# EAGLE design mfos_vco (EAGLE 7.2.0)
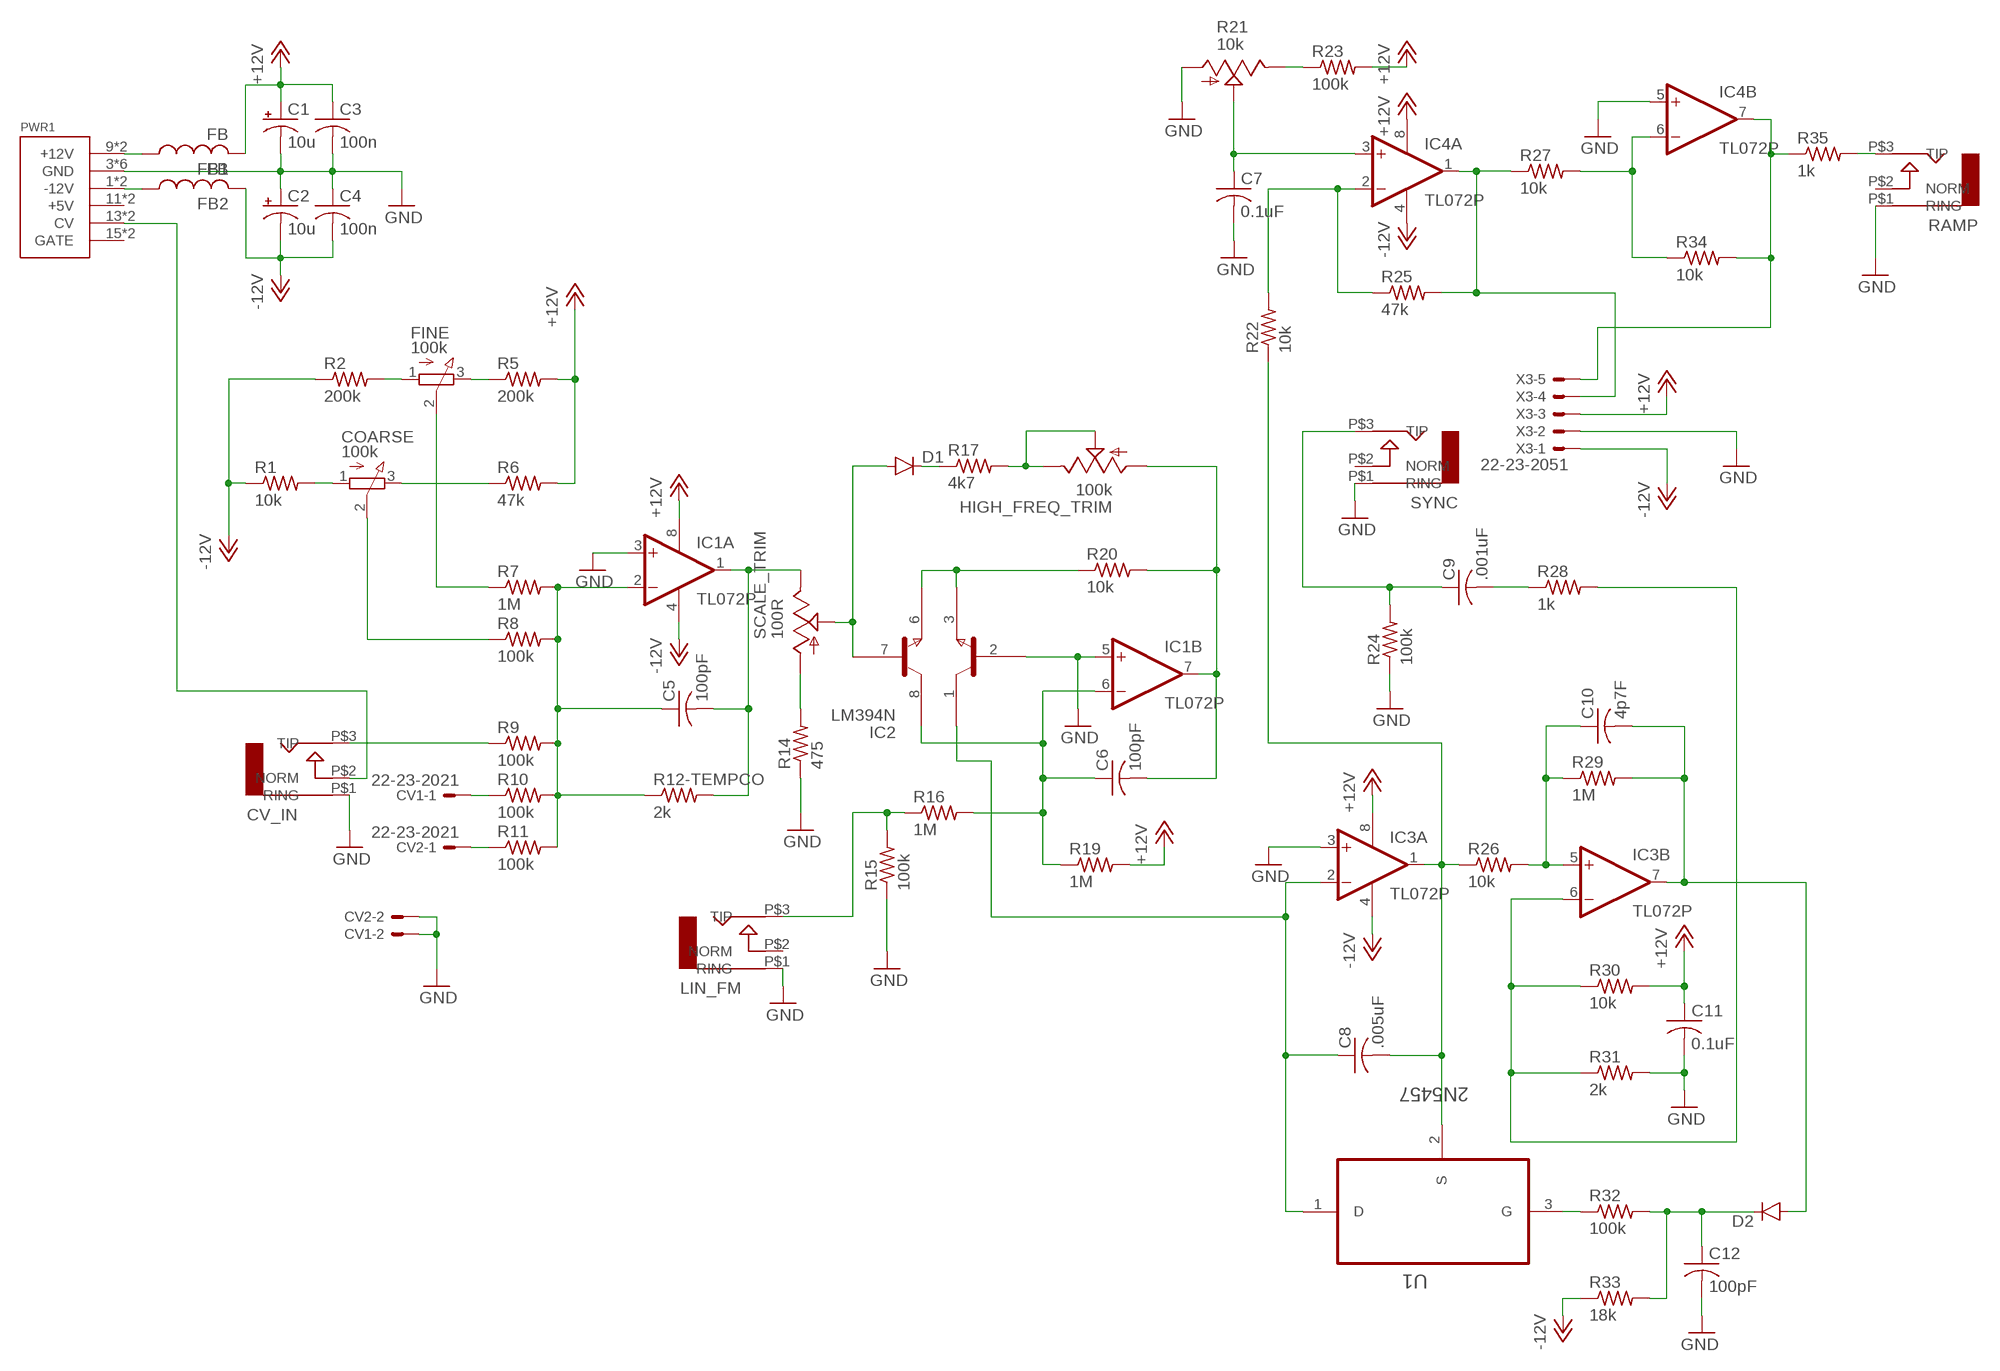
[diagram p0: schematic, sheet 1]

## Parts
C1  10u  CPOL-USB45181A  [B45181A]
C2  10u  CPOL-USB45181A  [B45181A]
C3  100n  C-US050-024X044  [C050-024X044]
C4  100n  C-US050-024X044  [C050-024X044]
C5  100pF  C-US050-024X044  [C050-024X044]
C6  100pF  C-US050-024X044  [C050-024X044]
C7  0.1uF  C-US050-024X044  [C050-024X044]
C8  .005uF  C-US050-024X044  [C050-024X044]
C9  .001uF  C-US050-024X044  [C050-024X044]
C10  4p7F  C-US050-024X044  [C050-024X044]
C11  0.1uF  C-US050-024X044  [C050-024X044]
C12  100pF  C-US050-024X044  [C050-024X044]
COARSE  100k  3RP/1610N  [3RP/1610N]
CV1  22-23-2021  [22-23-2021]
CV2  22-23-2021  [22-23-2021]
CV_IN  AUDIO-JACK  [ERTHENVAR-JACK-90DEG]
D1  DIODE1N4148  [DIODE-1N4148]
D2  DIODE1N4148  [DIODE-1N4148]
FB1  FB  [FB]
FB2  FB  [FB]
FINE  100k  3RP/1610N  [3RP/1610N]
HIGH_FREQ_TRIM  100k  TRIM_US-B64Y  [B64Y]
IC1  TL072P  [DIL08]
IC2  LM394N  [DIL08]
IC3  TL072P  [DIL08]
IC4  TL072P  [DIL08]
LIN_FM  AUDIO-JACK  [ERTHENVAR-JACK-90DEG]
PWR1  POWER  [POWER_16]
R1  10k  R-US_0207/7  [0207/7]
R2  200k  R-US_0207/7  [0207/7]
R5  200k  R-US_0207/7  [0207/7]
R6  47k  R-US_0207/7  [0207/7]
R7  1M  R-US_0207/7  [0207/7]
R8  100k  R-US_0207/7  [0207/7]
R9  100k  R-US_0207/7  [0207/7]
R10  100k  R-US_0207/7  [0207/7]
R11  100k  R-US_0207/7  [0207/7]
R12-TEMPCO  2k  R-US_0207/2V  [0207/2V]
R14  475  R-US_0207/7  [0207/7]
R15  100k  R-US_0207/7  [0207/7]
R16  1M  R-US_0207/7  [0207/7]
R17  4k7  R-US_0207/7  [0207/7]
R19  1M  R-US_0207/7  [0207/7]
R20  10k  R-US_0207/7  [0207/7]
R21  10k  TRIM_US-B64Y  [B64Y]
R22  10k  R-US_0207/7  [0207/7]
R23  100k  R-US_0207/10  [0207/10]
R24  100k  R-US_0207/7  [0207/7]
R25  47k  R-US_0207/7  [0207/7]
R26  10k  R-US_0207/7  [0207/7]
R27  10k  R-US_0207/7  [0207/7]
R28  1k  R-US_0207/7  [0207/7]
R29  1M  R-US_0207/7  [0207/7]
R30  10k  R-US_0207/7  [0207/7]
R31  2k  R-US_0207/7  [0207/7]
R32  100k  R-US_0207/7  [0207/7]
R33  18k  R-US_0207/7  [0207/7]
R34  10k  R-US_0207/7  [0207/7]
R35  1k  R-US_0207/7  [0207/7]
RAMP  AUDIO-JACK  [ERTHENVAR-JACK-90DEG]
SCALE_TRIM  100R  TRIM_US-B64Y  [B64Y]
SYNC  AUDIO-JACK  [ERTHENVAR-JACK-90DEG]
U1  2N5457  [TO127P254X732-3]
X3  22-23-2051  [22-23-2051]

## Nets
+12V: C1.+ C3.1 C11.1 FB1.P$2 IC1.8(P:V+) IC3.8(P:V+) IC4.8(P:V+) R5.2 R6.2 R19.2 R23.2 R30.2 X3.3
-12V: C2.- C4.2 FB2.P$2 IC1.4(P:V-) IC3.4(P:V-) IC4.4(P:V-) R1.1 R2.1 R33.1 X3.1
GND: C1.- C2.+ C3.2 C4.1 C7.2 C11.2 C12.2 CV1.2 CV2.2 CV_IN.P$1(RING) IC1.3(A:+IN) IC1.5(B:+IN) IC2.2(B1) IC3.3(A:+IN) IC4.5(B:+IN) LIN_FM.P$1(RING) PWR1.3(GND) PWR1.4(GND) PWR1.5(GND) PWR1.6(GND) PWR1.7(GND) PWR1.8(GND) R14.1 R15.1 R21.A R24.1 R31.2 RAMP.P$1(RING) SYNC.P$1(RING) X3.2
N$1: COARSE.1(A) R1.2
N$2: FINE.1(A) R2.2
N$3: FINE.3(E) R5.1
N$4: COARSE.3(E) R6.1
N$5: FINE.2(S) R7.1
N$6: COARSE.2(S) R8.1
N$7: R14.2 SCALE_TRIM.A
N$8: D1.A IC2.7(B2) SCALE_TRIM.S
N$9: C5.2 IC1.1(A:OUT) R12-TEMPCO.2 SCALE_TRIM.E
N$10: C5.1 IC1.2(A:-IN) R7.2 R8.2 R9.2 R10.2 R11.2 R12-TEMPCO.1
N$11: CV_IN.P$2(NORM) PWR1.13(CV) PWR1.14(CV)
N$12: IC2.3(E1) IC2.6(E2) R20.1
N$14: HIGH_FREQ_TRIM.E HIGH_FREQ_TRIM.S R17.2
N$15: D1.C R17.1
N$16: C6.2 HIGH_FREQ_TRIM.A IC1.7(B:OUT) R20.2
N$17: CV_IN.P$3(TIP) R9.1
N$18: CV1.1 R10.1
N$19: CV2.1 R11.1
N$20: LIN_FM.P$3(TIP) R15.2 R16.1
N$21: C8.2 IC3.1(A:OUT) R22.1 R26.1 U1.2(S)
N$22: C10.1 IC3.5(B:+IN) R26.2 R29.1
N$23: C8.1 IC2.1(C1) IC3.2(A:-IN) U1.1(D)
N$24: C9.2 R28.1
N$25: C9.1 R24.2 SYNC.P$3(TIP)
N$26: IC3.6(B:-IN) R28.2 R30.1 R31.1
N$27: R21.E R23.1
N$28: C7.1 IC4.3(A:+IN) R21.S
N$29: R32.1 U1.3(G)
N$30: C10.2 D2.A IC3.7(B:OUT) R29.2
N$31: IC4.2(A:-IN) R22.2 R25.1
N$32: C12.1 D2.C R32.2 R33.2
N$33: IC4.1(A:OUT) R25.2 R27.1 X3.4
N$34: IC4.6(B:-IN) R27.2 R34.1
N$35: IC4.7(B:OUT) R34.2 R35.1 X3.5
N$36: R35.2 RAMP.P$3(TIP)
N$38: FB1.P$1 PWR1.9(+12V) PWR1.10(+12V)
N$39: FB2.P$1 PWR1.1(-12V) PWR1.2(-12V)
N$40: C6.1 IC1.6(B:-IN) IC2.8(C2) R16.2 R19.1
Unconnected: LIN_FM.P$2(NORM) PWR1.11(+5V) PWR1.12(+5V) PWR1.15(GATE) PWR1.16(GATE) RAMP.P$2(NORM) SYNC.P$2(NORM)

## Library data of the parts
C1 C2 = rcl:CPOL-US: POLARIZED CAPACITOR, American symbol
C3-C12 = rcl:C-US: CAPACITOR, American symbol
COARSE FINE = pot:3RP/1610N: 16mm Potentiometer one level Source: http://www.alphapotentiometers.net/html/16mm_pot_2.html
CV1 CV2 = con-molex:22-23-2021: .100" (2.54mm) Center Header - 2 Pin; MF: MOLEX; MPN: 22-23-2021; OC_FARNELL: 1462926; OC_NEWARK: 25C3832
CV_IN LIN_FM RAMP SYNC = erthenvar:AUDIO-JACK: Switching Mono 3.5mm Audio Jack from Erthenvar.
D1 D2 = SparkFun-DiscreteSemi:DIODE: Diode These are standard reverse protection diodes and small signal diodes. SMA package can handle up to about 1A. SOD-323 can handle about 200mA. What the SOD-323 package when ordering, there are some mfgs out there that are 5-pin packages.
FB1 FB2 = adafruit:FB: Ferrite bead Digikey #P9821BK-ND
HIGH_FREQ_TRIM R21 SCALE_TRIM = pot:TRIM_US-: POTENTIOMETER
IC1 IC3 IC4 = linear:TL072: OP AMP
IC2 = synthdiy:LM394: National Dual TRANSISTOR
PWR1 = eurorack:POWER
R1 R2 R5-R11 R12-TEMPCO R14-R17 R19 R20 R22-R35 = rcl:R-US_: RESISTOR, American symbol
U1 = Fairchild_By_element14_Batch_1:2N5457: Transistor; MPN: 2N5457; OC_FARNELL: 1653694; OC_NEWARK: 58K2809; PACKAGE: TO-92; SUPPLIER: Fairchild
X3 = con-molex:22-23-2051: .100" (2.54mm) Center Header - 5 Pin; MF: MOLEX; MPN: 22-23-2051; OC_FARNELL: 1462952; OC_NEWARK: 38C9178

## Board
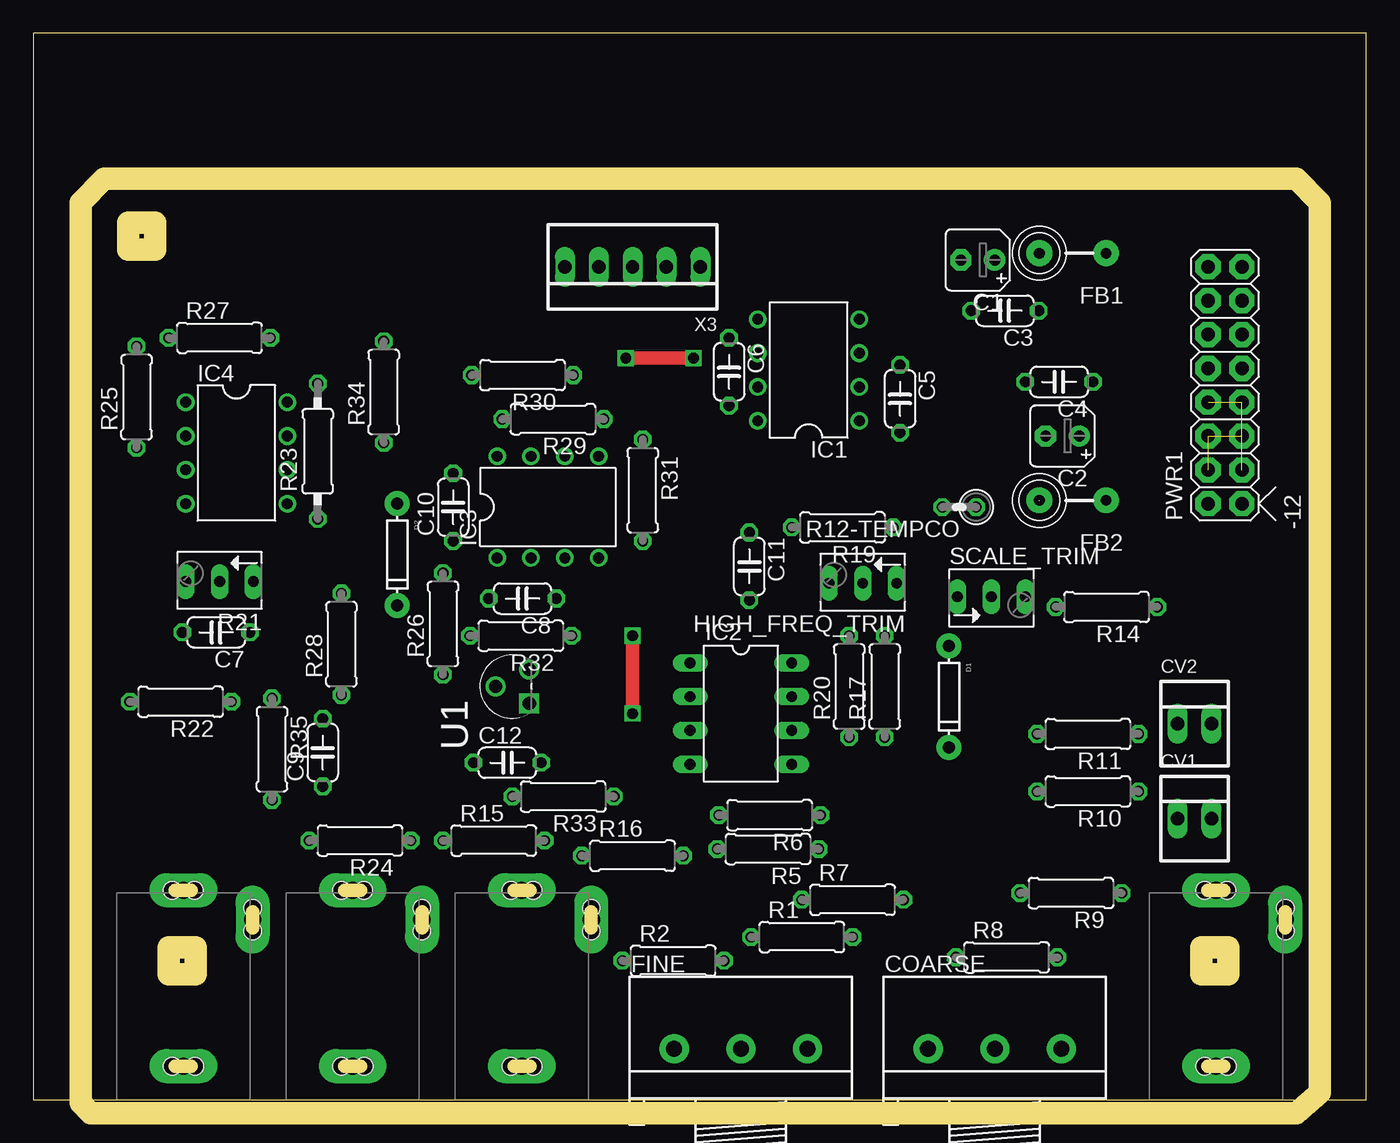
[diagram p1: board, top side]
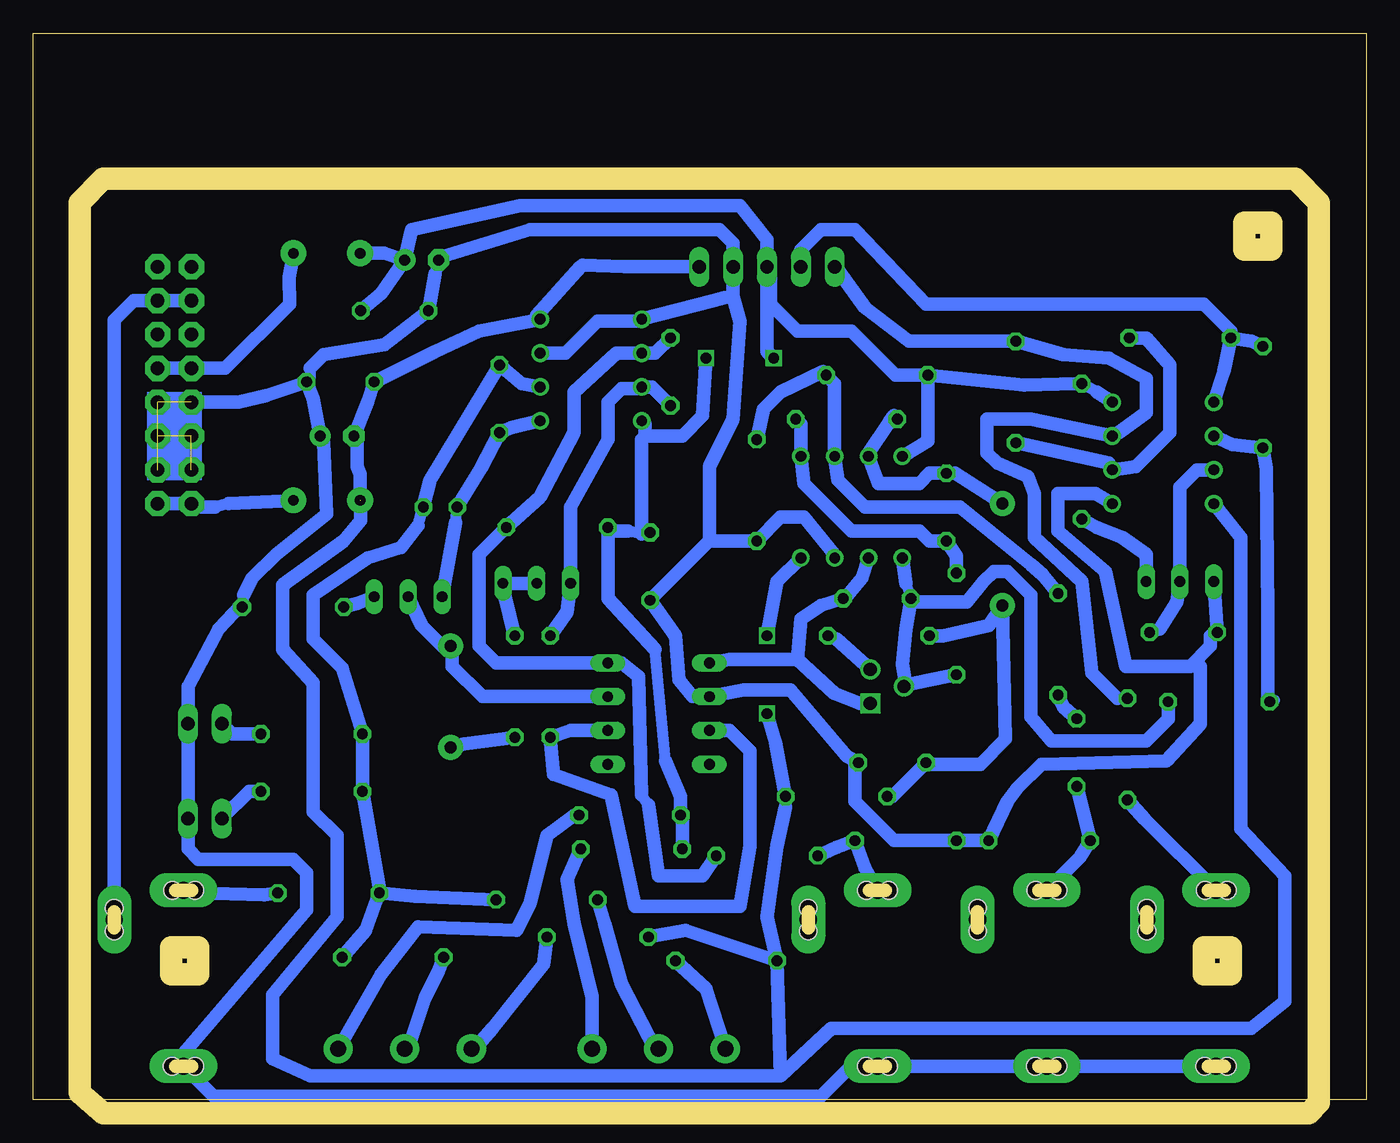
[diagram p2: board, bottom side, seen from below]

Size 100 x 80 mm. Coordinates in mm from the lower left corner, seen from the top.
Outline: 0,0 100,0 100,80 0,80 0,0
Copper layers (1*16): Top 0.035mm / dielectric 1.5mm / Bottom 0.035mm
Design rules "default *": minimum track width 26mil, minimum drill 31mil, track to track 18mil, track to pad 18mil, pad to pad 18mil, via to via 18mil, smd to smd 8mil, copper to edge 0mil, drill to drill 18mil, minimum pad ring 10mil, minimum via ring 8mil, stop-mask expansion 4mil, vias tented up to drill 0mil, thermal gap 10mil
Milling: 20 lines

### Footprints (pad centres in the part's own frame; a part is rotated, then mirrored left to right if it is on the bottom)
B45181A = drill 0.813 pad 1.6: + -1.27,0 | drill 0.813 pad 1.6 octagon: - 1.27,0
C050-024X044 = drill 0.813 octagon: 1 -2.54,0; 2 2.54,0
3RP/1610N = drill 1.2 pad 2.184: 1 -5,0; 2 0,0; 3 5,0
22-23-2021 = drill 1 long: 1 -1.27,0; 2 1.27,0
ERTHENVAR-JACK-90DEG = drill 1.3 pad 2.54 long: P$1 5,-2.5; P$2 -0.2,-13.5; P$3 5,-15.7 | hole 1.3: 5.842,-2.489; 4.14,-2.489; -0.203,-12.649; -0.203,-14.351; 5.842,-15.697; 4.166,-15.697
DIODE-1N4148 = drill 0.9 pad 1.88: A -3.81,0; C 3.81,0
FB = drill 0.8 pad 1.93: P$1 -2.5,0; P$2 2.5,0
B64Y = drill 0.813 long: A 2.54,0; E -2.54,0; S 0,0
DIL08 = drill 0.813 pad 1.27: 1 -3.81,-3.81; 2 -1.27,-3.81; 3 1.27,-3.81; 4 3.81,-3.81; 5 3.81,3.81; 6 1.27,3.81; 7 -1.27,3.81; 8 -3.81,3.81
DIL08' = drill 0.813 long: 1 -3.81,-3.81; 2 -1.27,-3.81; 3 1.27,-3.81; 4 3.81,-3.81; 5 3.81,3.81; 6 1.27,3.81; 7 -1.27,3.81; 8 -3.81,3.81
POWER_16 = drill 1.016 pad 1.88 octagon: 1 -6.35,-1.27; 2 -6.35,1.27; 3 -3.81,-1.27; 4 -3.81,1.27; 5 -1.27,-1.27; 6 -1.27,1.27; 7 1.27,-1.27; 8 1.27,1.27; 9 3.81,-1.27; 10 3.81,1.27; 11 6.35,-1.27; 12 6.35,1.27; 13 8.89,-1.27; 14 8.89,1.27; 15 11.43,-1.27; 16 11.43,1.27
0207/7 = drill 0.813 octagon: 1 -3.81,0; 2 3.81,0
0207/2V = drill 0.813 octagon: 1 -1.27,0; 2 1.27,0
0207/10 = drill 0.813 octagon: 1 -5.08,0; 2 5.08,0
TO127P254X732-3 = drill 0.991 square: 1 -2.54,-2.54 | drill 0.991: 2 -1.27,0; 3 0,-2.54
22-23-2051 = drill 1 long: 1 -5.08,0; 2 -2.54,0; 3 0,0; 4 2.54,0; 5 5.08,0

### Placement (x,y rotation side)
C1  70.87,62.99 180 top
C2  77.22,49.78 180 top
C3  72.9,59.18 180 top
C4  76.96,53.85 180 top
C5  65.02,52.58 270 top
C6  52.2,54.61 270 top
C7  13.72,35.05 180 top
C8  36.7,37.59 180 top
C9  21.72,26.04 90 top
C10  31.5,44.45 90 top
C11  53.72,40.01 270 top
C12  35.56,25.27 0 top
COARSE  72.14,3.81 0 top
CV1  87.12,21.08 0 top
CV2  87.12,28.19 0 top
CV_IN  93.73,0 180 top
D1  68.71,30.23 270 top
D2  27.3,40.89 270 top
FB1  77.98,63.5 180 top
FB2  77.98,44.96 180 top
FINE  53.09,3.81 0 top
HIGH_FREQ_TRIM  62.23,38.73 180 top
IC1  58.17,54.74 90 top
IC2  LM394N  [DIL08']  53.09,28.96 270 top
IC3  38.61,44.45 0 top
IC4  15.24,48.51 270 top
LIN_FM  41.66,0 180 top
PWR1  89.41,51.05 90 top
R1  57.66,12.19 0 top
R2  48.01,10.41 0 top
R5  55.12,18.8 180 top
R6  55.24,21.34 180 top
R7  61.47,14.99 0 top
R8  73.03,10.67 0 top
R9  77.85,15.49 180 top
R10  79.12,23.11 180 top
R11  79.12,27.43 180 top
R12-TEMPCO  69.47,44.45 180 top
R14  80.52,36.96 180 top
R15  34.54,19.43 0 top
R16  44.96,18.29 0 top
R17  63.88,30.99 90 top
R19  60.71,42.93 180 top
R20  61.21,30.99 90 top
R21  13.97,38.86 180 top
R22  11.05,29.84 180 top
R23  21.34,48.64 90 top
R24  24.51,19.43 180 top
R25  7.75,52.7 90 top
R26  30.73,35.69 90 top
R27  13.97,57.15 0 top
R28  23.11,34.16 90 top
R29  38.99,51.05 180 top
R30  36.7,54.36 180 top
R31  45.72,45.72 270 top
R32  36.58,34.8 180 top
R33  39.75,22.73 180 top
R34  26.29,53.09 90 top
R35  17.91,26.29 270 top
RAMP  16.26,0 180 top
SCALE_TRIM  71.88,37.72 0 top
SYNC  28.96,0 180 top
U1  34.67,32.26 90 top
X3  44.96,62.48 180 top

### Tracks (layer width: path | path; a pad name or v marks a point on that pad's centre or on a via)
+12V  (via drill 0.8)
  Top 1.016: v44.45,55.63 v49.53,55.63
  Bottom 0.813: 20.19,53.09 R23.2 21.72,53.72 | C11.1 54.36,42.42 55.37,42.67 | 51.31,21.21 R6.2 | 52.58,25.4 53.34,33.78 | 56.64,42.67 R19.2 | 44.7,62.23 X3.3 | 54.1,49.78 54.36,49.53
  Bottom 1.016: IC4.8 20.19,53.09 | 21.72,53.72 25.65,53.59 R30.2 | 54.36,49.53 54.36,42.42 | R30.2 32.89,49.4 IC3.8 | C1.+ 73.7,63.5 FB1.P$2 | C3.1 73.91,60.45 C1.+ | C1.+ 71.63,65.28 63.5,67.06 46.99,67.06 44.96,64.52 X3.3 44.96,56.13 v44.45,55.63 | R5.2 51.31,21.21 | R6.2 51.44,22.73 52.58,25.4 | 53.34,33.78 56.9,37.59 R19.2 | 55.37,42.67 56.64,42.67 | R30.2 35.31,54.36 38.61,57.66 42.67,57.66 44.7,59.69 44.7,62.23 | v49.53,55.63 49.78,51.31 51.31,49.78 54.1,49.78 54.1,50.67 IC1.8
-12V  (via drill 0.8)  (1 unrouted)
  Top 1.016: v44.96,28.96 v44.96,34.8
  Bottom 0.813: R33.1 43.56,21.97 | 58.93,62.48 58.8,62.61 | 75.69,49.53 C2.- | 62.23,58.8 61.85,58.55
  Bottom 1.016: 43.56,21.97 44.2,19.05 44.96,13.72 R2.1 | R1.1 51.05,12.7 R2.1 | X3.1 55.63,62.48 58.8,62.61 | 58.93,62.48 62.23,58.8 | R33.1 44.32,26.8 v44.96,28.96 | v44.96,34.8 44.2,38.86 IC3.4 | IC4.4 9.4,42.16 9.4,20.32 6.1,16.76 6.1,7.37 8.64,5.33 40.13,5.33 43.94,1.78 | R2.1 43.94,1.78 | FB2.P$2 75.48,46.95 75.69,47.5 75.69,49.53 | C2.- 74.93,52.32 C4.2 69.85,56.13 66.55,57.66 61.85,58.55 IC1.4 | 43.94,1.78 79.25,1.78 82.04,3.05 82.04,7.87 77.22,13.72 77.22,19.81 78.99,21.59 78.99,31.24 81.28,33.78 81.28,38.61 76.71,41.91 75.44,43.43 75.44,44.96
GND  (5 unrouted)
  Bottom 0.813: 12.45,32.51 13.21,32.51 | 11.68,34.8 C7.2 | 28.32,19.18 R24.1 | 31.46,2.5 32.26,2.54 | 38.35,25.02 C12.2 | CV_IN.P$1 88.73,3.48 | 84.45,37.08 R14.1 84.2,37.85 | 47.5,60.45 47.5,60.33 48.13,60.16 | IC3.3 39.88,40.89 | IC2.2 50.55,30.23 | C1.- 69.85,61.98 69.34,62.99 69.34,63.25 | 78.23,49.28 C2.+ | 79.25,54.86 79.25,54.1 C4.1 | 53.59,37.34 C11.2 | 49.28,41.91 49.4,41.78 49.28,42.16 | 54.48,58.42 IC1.5 | LIN_FM.P$1 36.87,2.5 37.08,2.29 36.87,2.29 LIN_FM.P$1
  Bottom 1.016: C7.2 R21.A | IC4.5 20.32,45.47 23.11,45.47 23.11,42.67 19.56,39.62 18.03,32.51 13.21,32.51 11.68,34.04 11.68,34.8 | 12.45,32.51 12.45,28.19 14.99,25.4 24.38,25.15 26.16,23.37 26.92,22.35 R24.1 R15.1 35.43,19.43 38.35,22.35 38.35,25.02 | RAMP.P$1 SYNC.P$1 31.46,2.5 LIN_FM.P$1 38.65,2.5 40.89,0.25 86.48,0.25 CV_IN.P$1 | C12.2 38.99,25.78 43.18,30.73 46.74,30.73 IC2.2 | 88.73,3.48 79.5,14.22 79.5,17.02 80.52,18.03 87.63,18.03 88.39,18.8 CV1.2 CV2.2 88.39,30.99 86.11,35.31 84.45,37.08 | 48.13,60.16 48.96,59.95 IC1.5 | 39.88,40.89 42.16,43.69 43.94,43.69 R31.2 49.28,41.91 | 84.2,37.85 83.57,39.12 81.79,40.89 77.98,43.94 78.23,49.28 | 50.55,30.23 51.56,31.5 51.82,34.8 C11.2 49.4,41.78 | C2.+ 78.99,52.58 C4.1 82.55,52.83 84.58,52.32 PWR1.8 | 79.25,54.86 78.23,55.88 73.66,56.64 C3.2 69.85,61.98 | 69.34,63.25 62.74,65.28 48.51,65.28 47.5,64.26 X3.2 47.5,60.45 47.56,60.39 46.99,58.36 47.5,51.05 49.28,47.5 49.28,42.16 | 54.48,58.42 57.66,58.42 60.07,56.01 IC1.3
N$1
  Bottom 0.813: 66.88,3.81 COARSE.1
  Bottom 1.016: R1.2 61.72,10.16 65.53,5.33 66.88,3.81
N$2
  Bottom 1.016: R2.2 49.53,8.3 FINE.1
N$3
  Bottom 1.016: FINE.3 58.09,7.7 59.44,13.21 59.94,16.51 R5.1
N$4
  Bottom 0.813: 76.71,4.49 COARSE.3 | R6.1 59.44,21.34
  Bottom 1.016: 76.71,4.49 73.91,9.4 71.12,12.95 63.75,12.7 62.74,14.73 61.47,19.81 59.44,21.34
N$5
  Bottom 0.813: FINE.2 53.34,3.81
  Bottom 1.016: 53.34,3.81 55.88,8.64 57.15,13.21 R7.1
N$6
  Bottom 0.813: 71.88,3.81 COARSE.2
  Bottom 1.016: R8.1 69.6,9.65 70.61,7.62 71.88,3.81
N$7
  Bottom 1.016: SCALE_TRIM.A 75.69,37.21 R14.2
N$8
  Bottom 0.813: 68.58,33.91 D1.A 69.34,34.04
  Bottom 1.016: IC2.7 66.29,30.23 68.58,32.51 68.58,33.91 | 69.34,34.04 70.87,35.56 SCALE_TRIM.S
N$9
  Bottom 0.813: 68.33,43.31 R12-TEMPCO.2
  Bottom 1.016: R12-TEMPCO.2 66.42,47.37 C5.2 64.14,50.42 IC1.1 | SCALE_TRIM.E 68.33,43.31
N$10
  Bottom 0.813: 71.12,43.05 R12-TEMPCO.1 | R9.2 74.04,16
  Bottom 1.016: IC1.2 63.37,53.72 C5.1 70.23,46.48 R12-TEMPCO.1 | R8.2 75.06,12.7 R9.2 71.37,15.24 R7.2 | 71.12,43.05 72.39,41.4 74.93,40.64 78.99,37.85 78.99,34.54 76.83,32.38 R11.2 R10.2 74.04,16
N$11
  Bottom 1.016: CV_IN.P$2 93.93,58.47 92.46,59.94 PWR1.13 PWR1.14
N$12
  Bottom 1.016: IC2.6 59.69,27.69 R20.1 60.96,24.38 56.64,22.86 54.86,14.48 46.99,14.48 46.23,19.05 46.23,26.16 47.75,27.69 IC2.3
N$14
  Bottom 0.813: 64.64,37.85 HIGH_FREQ_TRIM.E
  Bottom 1.016: HIGH_FREQ_TRIM.E HIGH_FREQ_TRIM.S | R17.2 64.64,37.85
N$15
  Bottom 1.016: R17.1 67.69,26.67 D1.C
N$16
  Bottom 0.813: 54.48,53.34 IC1.7
  Bottom 1.016: R20.2 59.94,36.58 HIGH_FREQ_TRIM.A 59.69,44.45 56.9,49.53 56.9,52.32 55.88,53.34 54.48,53.34 | IC1.7 53.59,53.47 C6.2
N$17
  Bottom 0.813: 87.88,15.49 87,15.75 CV_IN.P$3
  Bottom 1.016: R9.1 82.68,15.37 87.88,15.49
N$18
  Bottom 1.016: R10.1 83.82,23.11 CV1.1
N$19
  Bottom 1.016: R11.1 85.09,27.43 CV2.1
N$20
  Bottom 1.016: LIN_FM.P$3 37.59,17.4 R15.2 39.75,18.92 R16.1
N$21
  Bottom 0.813: 34.54,31.11 U1.2 | C8.2 34.16,37.47 | 34.54,38.73 C8.2 | 33.91,37.34 C8.2
  Bottom 1.016: 34.16,37.47 34.54,35.31 34.8,32.64 34.54,31.11 R26.1 | IC3.1 34.54,38.73 | R22.1 14.86,28.57 16.51,26.92 23.62,26.92 25.15,28.7 25.15,37.85 26.92,39.62 27.94,39.62 28.7,38.86 29.97,37.34 33.91,37.34
N$22
  Bottom 0.813: 42.42,50.67 R29.1
  Bottom 1.016: 42.42,50.67 IC3.5 42.16,46.23 38.61,42.67 33.53,42.67 32.77,41.91 C10.1 30.73,40.77 R26.2
N$23
  Bottom 0.813: 37.97,29.72 U1.1 | C8.1 39.12,37.59
  Bottom 1.016: C8.1 40.89,37.08 42.42,36.07 42.67,33.02 | 42.67,33.02 39.88,30.48 37.97,29.72 | 42.67,33.02 47.75,33.02 IC2.1 | 39.12,37.59 37.85,39.12 IC3.2
N$24
  Bottom 1.016: C9.2 22.73,29.46 R28.1
N$25
  Bottom 1.016: SYNC.P$3 21.5,18.16 R24.2 C9.1
N$26
  Bottom 0.813: 40.77,54.61 R30.1
  Bottom 1.016: R31.1 45.21,51.82 43.94,53.09 40.77,54.61 | R30.1 39.88,53.72 IC3.6 39.62,46.48 37.59,44.45 30.48,44.45 25.15,40.13 24.26,39.37 R28.2
N$27
  Bottom 1.016: R21.E 16.51,40.89 18.29,42.16 20.19,42.93 R23.1
N$28
  Bottom 1.016: IC4.3 12.7,47.24 13.97,45.97 R21.S 14.22,37.34 15.49,35.31 C7.1
N$29
  Bottom 0.813: R32.1 39.75,34.54
  Bottom 1.016: 39.75,34.54 U1.3
N$30
  Bottom 0.813: C10.2 30.86,46.99 | 35.43,51.31 R29.2
  Bottom 1.016: 30.86,46.99 D2.A | C10.2 32.77,46.99 33.53,46.23 36.58,46.23 IC3.7 37.34,48.51 35.81,50.8 35.43,51.31
N$31
  Bottom 0.813: 7.37,29.97 6.86,29.97 R22.2
  Bottom 1.016: IC4.2 10.03,49.15 R25.1 7.49,47.37 7.37,36.58 7.37,29.97
N$32
  Bottom 0.813: R33.2 35.56,22.73 | 32.89,25.15 C12.1
  Bottom 1.016: 35.56,22.73 C12.1 | R32.2 31.75,34.8 28.32,35.56 D2.C 27.05,27.05 28.96,25.15 32.89,25.15
N$33
  Bottom 0.813: X3.4 42.42,63.75 | 10.16,57.66 R27.1
  Bottom 1.016: 42.42,63.75 40.89,65.28 38.35,65.28 33.02,59.69 12.19,59.69 10.16,57.66 | IC4.1 10.67,54.61 R27.1 8.64,56.9 R25.2
N$34
  Bottom 0.813: 19.3,47.75 IC4.6
  Bottom 1.016: R34.1 19.3,47.75 | R27.2 16.51,57.15 14.73,55.12 14.73,50.04 17.27,47.5 IC4.6
N$35
  Bottom 0.813: 39.62,62.23 X3.5 | R35.1 18.67,30.1 | IC4.7 18.54,50.04
  Bottom 1.016: 39.62,62.23 37.59,59.44 34.29,56.9 R34.2 22.73,55.88 19.3,55.63 16.51,54.1 16.51,51.56 18.54,50.04 | 18.67,30.1 20.57,32 21.34,38.86 24.89,42.16 24.89,45.47 25.4,46.74 27.69,47.75 28.45,48.51 28.45,51.05 25.15,51.05 IC4.7
N$36
  Bottom 1.016: RAMP.P$3 16.59,21 R35.2
N$38
  Bottom 1.016: FB1.P$1 80.81,61.72 80.77,59.69 85.6,54.86 PWR1.10 PWR1.9
N$39
  Bottom 0.813: 85.34,44.7 86.36,44.45 | 87.88,44.45 PWR1.2
  Bottom 1.016: FB2.P$1 85.34,44.7 | 86.36,44.45 87.88,44.45 | PWR1.1 PWR1.2
N$40
  Bottom 0.813: 53.85,22.1 54.36,22.86 | 55.88,32.77 IC2.8
  Bottom 1.016: R16.2 49.78,16.76 53.09,16.76 53.85,22.1 | 54.36,22.86 54.61,31.75 55.88,32.77 | C6.1 53.34,56.01 IC1.6 56.26,56.01 59.44,53.09 59.44,50.04 61.98,45.21 R19.1 66.55,40.89 66.55,34.04 65.28,32.77 IC2.8
(copper drawn outside any net)
  shapes: Bottom area x1